# EAGLE design design (EAGLE 9.7.0)
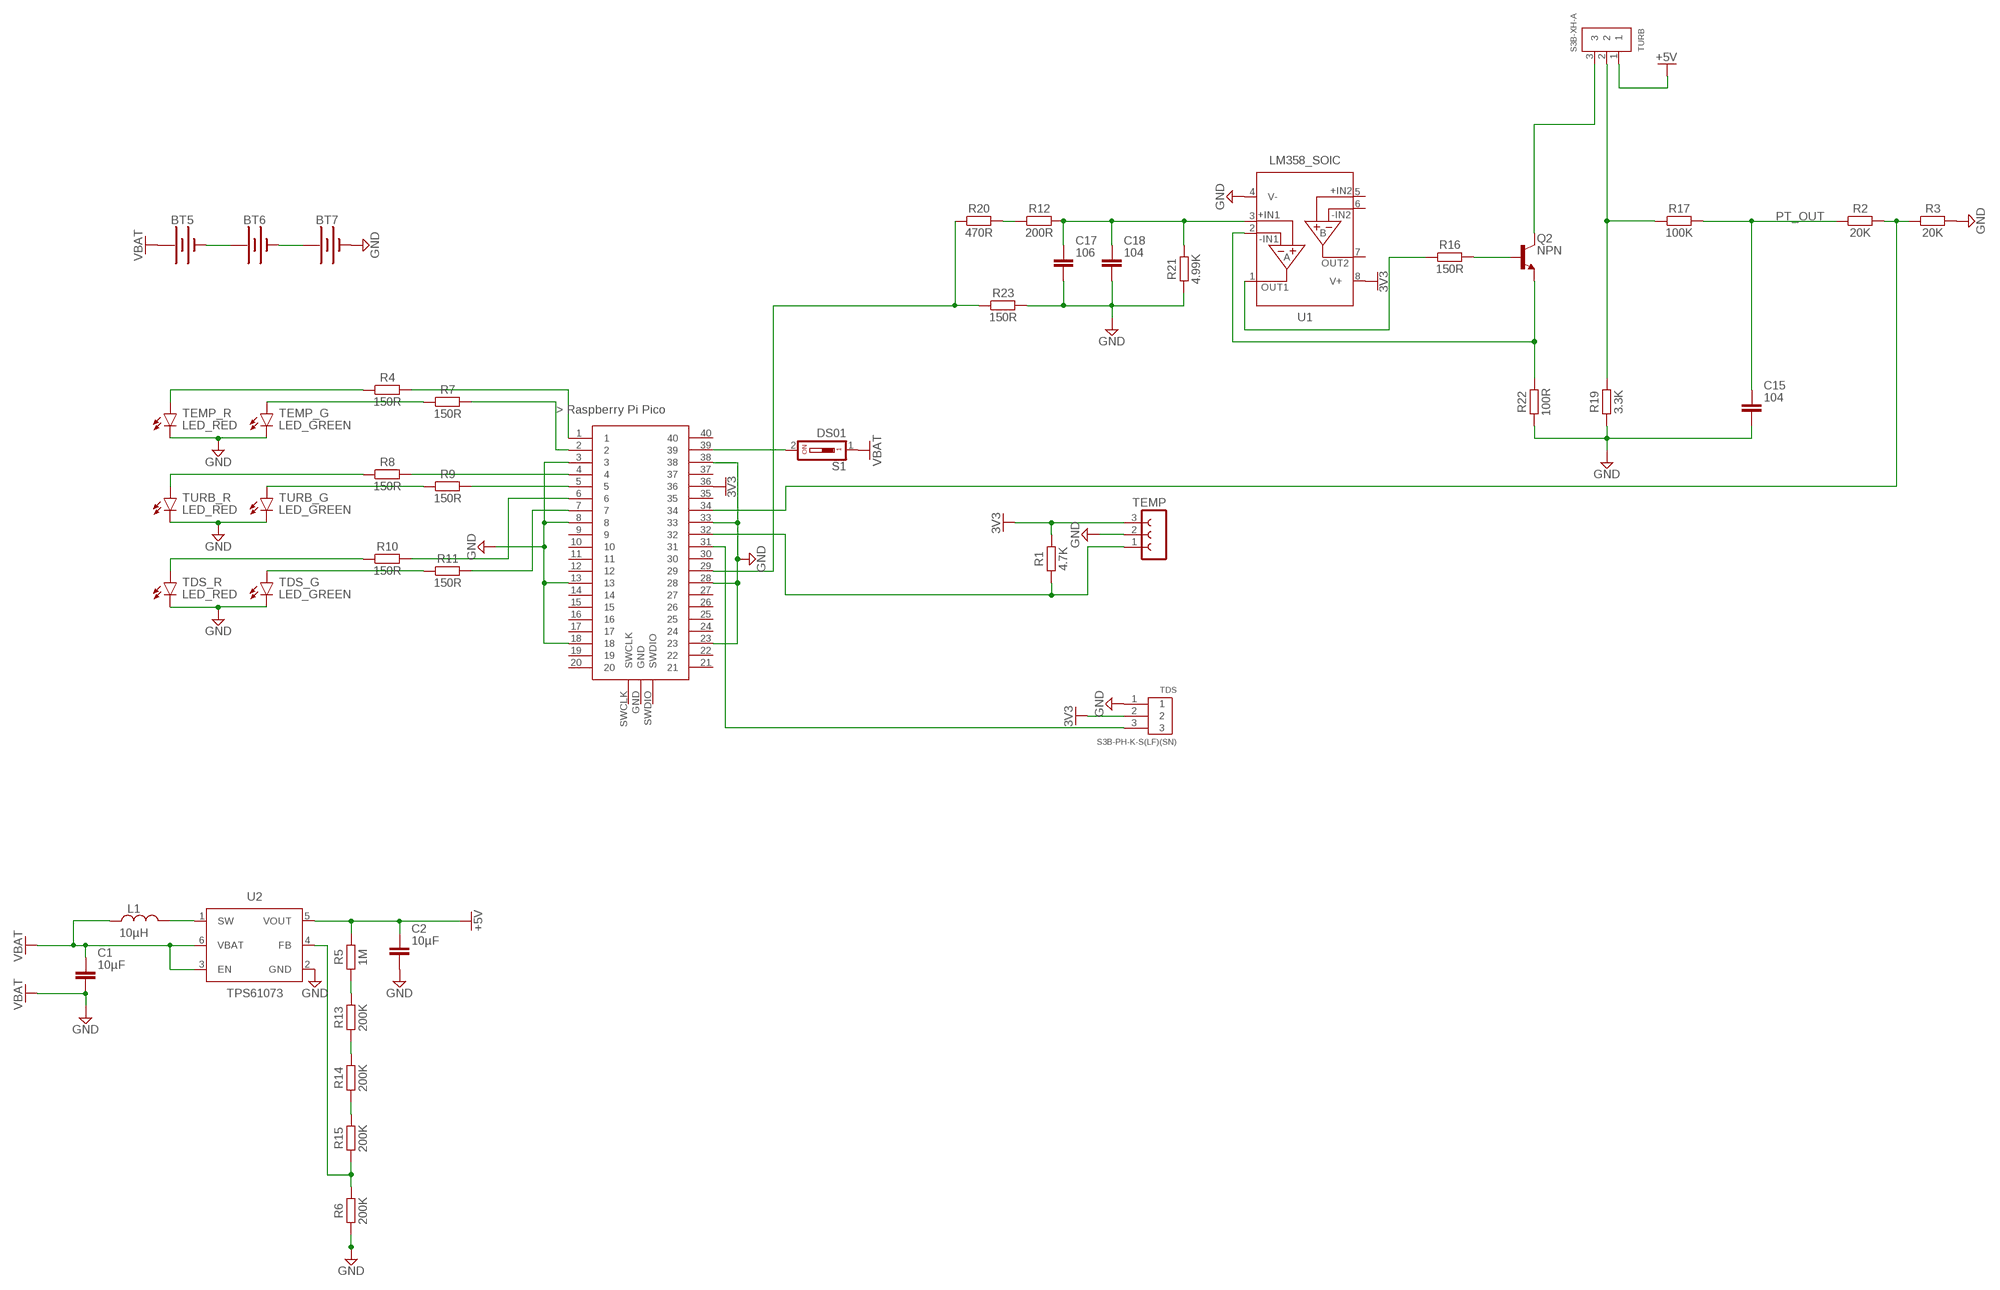
[diagram p0: schematic, sheet 1]

## Parts
BT5  BATTERY-AA_KIT  [BATTERY-AA-KIT]
BT6  BATTERY-AA_KIT  [BATTERY-AA-KIT]
BT7  BATTERY-AA_KIT  [BATTERY-AA-KIT]
C1  10µF  C_CHIP-0805(2012-METRIC)  [CAPC2012X110]
C2  10µF  C_CHIP-0805(2012-METRIC)  [CAPC2012X110]
C15  104  C_CHIP-0402(1005-METRIC)  [CAPC1005X60]
C17  106  C_CHIP-0402(1005-METRIC)  [CAPC1005X60]
C18  104  C_CHIP-0402(1005-METRIC)  [CAPC1005X60]
L1  10µH  L_CHIP-0805(2012-METRIC)  [INDC2009X120]
Q2  NPN  NPN_SOT23-BEC  [SOT95P237X112-3N]
R1  4.7K  R_CHIP-0402(1005-METRIC)  [RESC1005X40]
R2  20K  R_CHIP-0402(1005-METRIC)  [RESC1005X40]
R3  20K  R_CHIP-0402(1005-METRIC)  [RESC1005X40]
R4  150R  R_CHIP-0402(1005-METRIC)  [RESC1005X40]
R5  1M  R_CHIP-0402(1005-METRIC)  [RESC1005X40]
R6  200K  R_CHIP-0402(1005-METRIC)  [RESC1005X40]
R7  150R  R_CHIP-0402(1005-METRIC)  [RESC1005X40]
R8  150R  R_CHIP-0402(1005-METRIC)  [RESC1005X40]
R9  150R  R_CHIP-0402(1005-METRIC)  [RESC1005X40]
R10  150R  R_CHIP-0402(1005-METRIC)  [RESC1005X40]
R11  150R  R_CHIP-0402(1005-METRIC)  [RESC1005X40]
R12  200R  R_CHIP-0402(1005-METRIC)  [RESC1005X40]
R13  200K  R_CHIP-0402(1005-METRIC)  [RESC1005X40]
R14  200K  R_CHIP-0402(1005-METRIC)  [RESC1005X40]
R15  200K  R_CHIP-0402(1005-METRIC)  [RESC1005X40]
R16  150R  R_CHIP-0402(1005-METRIC)  [RESC1005X40]
R17  100K  R_CHIP-0402(1005-METRIC)  [RESC1005X40]
R19  3.3K  R_CHIP-0402(1005-METRIC)  [RESC1005X40]
R20  470R  R_CHIP-0402(1005-METRIC)  [RESC1005X40]
R21  4.99K  R_CHIP-0603(1608-METRIC)  [RESC1608X60]
R22  100R  R_CHIP-0402(1005-METRIC)  [RESC1005X40]
R23  150R  R_CHIP-0402(1005-METRIC)  [RESC1005X40]
S1  DS01  [DS-01]
TDS  S3B-PH-K-S(LF)(SN)  [S3B-PH-K-S(LF)(SN)]
TDS_G  LED_GREEN  CHIP-ROUND-G_0603  [LEDC1608X65N_RND-G]
TDS_R  LED_RED  CHIP-ROUND-R_0603  [LEDC1608X65N_RND-R]
TEMP  FE03-1  [FE03-1]
TEMP_G  LED_GREEN  CHIP-ROUND-G_0603  [LEDC1608X65N_RND-G]
TEMP_R  LED_RED  CHIP-ROUND-R_0603  [LEDC1608X65N_RND-R]
TURB  S3B-XH-A  [S3B-XH-A]
TURB_G  LED_GREEN  CHIP-ROUND-G_0603  [LEDC1608X65N_RND-G]
TURB_R  LED_RED  CHIP-ROUND-R_0603  [LEDC1608X65N_RND-R]
U1  LM358_SOIC  [SOIC127P600X175-8N]
U2  TPS61073  TPS61073DDCR_SOT23  [SOT95P280X110-6N]
U$1  RASPBERRY-PI-PICO_TH  [FT_RASPBERRY-PI-PICO_TH]

## Nets
3V3: R1.2 TDS.2 TEMP.3 U1.8(V+) U$1.36
+5V: C2.1 R5.2 TURB.1 U2.5(VOUT)
GND: BT7.GND@1(-) C1.2 C2.2 C15.2 C17.2 C18.2 R3.2 R6.1 R19.1 R21.1 R22.1 R23.2 TDS.1 TDS_G.C TDS_R.C TEMP.2 TEMP_G.C TEMP_R.C TURB_G.C TURB_R.C U1.4(V-) U2.2(GND) U$1.3 U$1.8 U$1.13 U$1.18 U$1.23 U$1.28 U$1.33 U$1.38 ; supply symbol labelled VBAT
N$1: BT5.GND@1(-) BT6.PWR@1(+)
N$2: BT6.GND@1(-) BT7.PWR@1(+)
N$3: R1.1 TEMP.1 U$1.32
N$4: R20.1 R23.1 U$1.29
N$6: R2.2 R3.1 U$1.34
N$7: TDS.3 U$1.31
N$8: R4.1 TEMP_R.A
N$9: R7.1 TEMP_G.A
N$10: R8.1 TURB_R.A
N$11: R9.1 TURB_G.A
N$12: R11.1 TDS_G.A
N$13: R10.2 U$1.6
N$14: S1.2 U$1.39
N$16: L1.2 U2.1(SW)
N$17: R4.2 U$1.1
N$18: R7.2 U$1.2
N$19: R8.2 U$1.4
N$20: R9.2 U$1.5
N$21: R10.1 TDS_R.A
N$22: R11.2 U$1.7
N$23: R12.1 R20.2
N$24: R5.1 R13.2
N$25: R13.1 R14.2
N$26: R14.1 R15.2
N$27: R6.2 R15.1 U2.4(FB)
N$45: C17.1 C18.1 R12.2 R21.2 U1.3(+IN1)
N$47: R16.1 U1.1(OUT1)
N$48: Q2.1(B) R16.2
N$49: Q2.2(E) R22.2 U1.2(-IN1)
N$50: Q2.3(C) TURB.3
N$51: R17.1 R19.2 TURB.2
PT_OUT: C15.1 R2.1 R17.2
VBAT: BT5.PWR@1(+) C1.1 L1.1 S1.1 U2.3(EN) U2.6(VBAT)
Unconnected: U1.5(+IN2) U1.6(-IN2) U1.7(OUT2) U$1.9 U$1.10 U$1.11 U$1.12 U$1.14 U$1.15 U$1.16 U$1.17 U$1.19 U$1.20 U$1.21 U$1.22 U$1.24 U$1.25 U$1.26 U$1.27 U$1.30 U$1.35 U$1.37 U$1.40 U$1.GND U$1.SWCLK U$1.SWDIO

## Library data of the parts
BT5-BT7 = SparkFun-Batteries:BATTERY: Battery - Single Cell A variety of battery chemistries, sizes, and footprints. Device List: 20MM_PTH - Coin Cell Battery Holder - 20mm (PTH) <https://www.sparkfun.com/products/783> 20MM_PTH_KIT- Coin Cell battery Holder - 20 mm (PTH) <http://www.sparkfun.com/products/783>kit version with special mask 6.8MM_PTH - Coin Cell Battery Holder - 6.8MM(SMD) <https://www.digikey.com/product-detail/en/seiko-instruments/MS621FE-FL11E/728-1057-ND/1889208?WT.srch=1&gclid=CNOQ5a6LzdQCFZS2wAodXCkE0g> 12MM_SMD - Coin Cell Battery Holder - 12mm (SMD) <https://www.sparkfun.com/products/10592> 12MM_PTH - Coin Cell Battery Holder - 12mm (PTH) <https://www.sparkfun.com/products/7948> 20MM_SMD - 20mm Coin Cell Battery Holder (SMD) (2 legs) Used on the Big Time Watch Kit <https://www.sparkfun.com/products/11734> 20MM_SMD_4LEGS - Coin Cell Battery Holder - 20mm (SMD) <https://www.sparkfun.com/products/11892> 20MM_SMD_4LEGS_OVERPASTE - Coin Cell Battery Holder - 20mm (SMD) <https://www.sparkfun.com/products/11892> (Over-paste on the legs) 24.5MM_PTH - Coin Cell Battery Holder - 24.5mm (PTH) <https://www.sparkfun.com/products/8863> 9V - 9V Battery Holder - PC Mount Used on the SparkFun SparkPunk Sound Kit <https://www.sparkfun.com/products/11177> and SparkFun SparkPunk Sequencer Kit <https://www.sparkfun.com/products/12707> 18650 - Battery Holder - 18650 (PTH) <https://www.sparkfun.com/products/13113> AA - Battery Holder - 1xAA (PTH) <https://www.sparkfun.com/products/7949> AAA - Battery Holder - 1xAAA (PTH) <https://www.sparkfun.com/products/12718> AA_KIT - Battery Holder - 1xAA (PTH) <https://www.sparkfun.com/products/7949> Special kit package - pads only have exposed copper on one side of the board. AAA_KIT - Battery Holder - 1xAAA (PTH) <https://www.sparkfun.com/products/12718> Special kit package - pads only have exposed copper on one side of the board.; PROD_ID: BATT-08316; SF_SKU: PRT-07949
C1 C2 C15 C17 C18 = Capacitor:C: Capacitor - Generic; CATEGORY: Capacitor
L1 = Inductor:L: Inductor Fixed - Generic; CATEGORY: Inductor; SUB-CATEGORY: Fixed
Q2 = Transistor:NPN: NPN - Generic; CATEGORY: Transistor; SUB-CATEGORY: BJT; TYPE: NPN
R1-R17 R19-R23 = Resistor:R: Resistor Fixed - Generic; CATEGORY: Resistor; SUB-CATEGORY: Fixed
S1 = Switch:DS01: DIL/CODE SWITCH; CATEGORY: SWITCH; TYPE: SPST
TDS = Headers:S3B-PH-K-S(LF)(SN): CONN HEADER R/A 4POS 2MM Manufacturer's datasheet <http://www.jst-mfg.com/product/pdf/eng/ePH.pdf>
TDS_G TEMP_G TURB_G = LED:CHIP-ROUND-G; CATEGORY: LED; COLOR: GREEN; DESCRIPTION: CHIP LED ROUND; SUB-CATEGORY: CHIP; TYPE: ROUND_TOP
TDS_R TEMP_R TURB_R = LED:CHIP-ROUND-R: LED - Generic; CATEGORY: LED; COLOR: RED; DESCRIPTION: CHIP LED ROUND; SUB-CATEGORY: CHIP; TYPE: ROUND_TOP
TEMP = con-lsta:FE03-1: FEMALE HEADER
TURB = Connector:S3B-XH-A; CATEGORY: Header; DESCRIPTION: Connector Header Through Hole, Right Angle 3 position 0.098" (2.50mm); MANUFACTURER: JST Sales America Inc.; MPN: S3B-XH-A(LF)(SN); OPERATING_TEMPERATURE: -25°C ~ 85°C; PART_STATUS: Active; PITCH: 0.098" (2.50mm); ROHS_COMPLIANCE: ROHS3 Compliant; SERIES: XH; SUBCATEGORY: Rectangular Connectors; TYPE: Header, Male Pin, Board to Cable/Wire, Through Hole
U1 = IC_Linear:LM358: Dual Operational Amplifier Reference Datasheet <https://www.ti.com/lit/ds/symlink/lm158-n.pdf>; CATEGORY: Amplifier; DESCRIPTION: Dual Operational Amplifier; MANUFACTURER: Generic; MPN: Generic; SERIES: LM358; SUB-CATEGORY: OpAmp; TYPE: Dual
U2 = IC_Power-Management:TPS6107: Synchronous Boost Converter With 600-mA Switch Datasheet <https://www.ti.com/lit/ds/symlink/tps61070.pdf?ts=1593507986589&ref_url=https%253A%252F%252Fwww.ti.com%252Fstore%252Fti%252Fen%252Fp%252Fproduct%252F%253Fp%253DTPS61070DDCR>; CATEGORY: IC_Power-Management; DESCRIPTION: IC REG BOOST ADJ 500MA TSOT23-6; INPUT_VOLTAGE: 0.9V to 5.5V; MANUFACTURER: TI; MPN: TPS61073DDCR; OPERATING_TEMP: -40°C ~ 85°C; OUTPUT_VOLTAGE: 1.8V to 5.5V; PART_STATUS: Active; ROHS_COMPLIANT: Yes; SUB-CATEGORY: Voltage Regulator; TOPOLOGY: Boost; TYPE: DC-DC Switching
U$1 = Pipico (1):RASPBERRY-PI-PICO_TH: Raspberry Pi Pico microcontroller board for through-hole mounting.

## Board
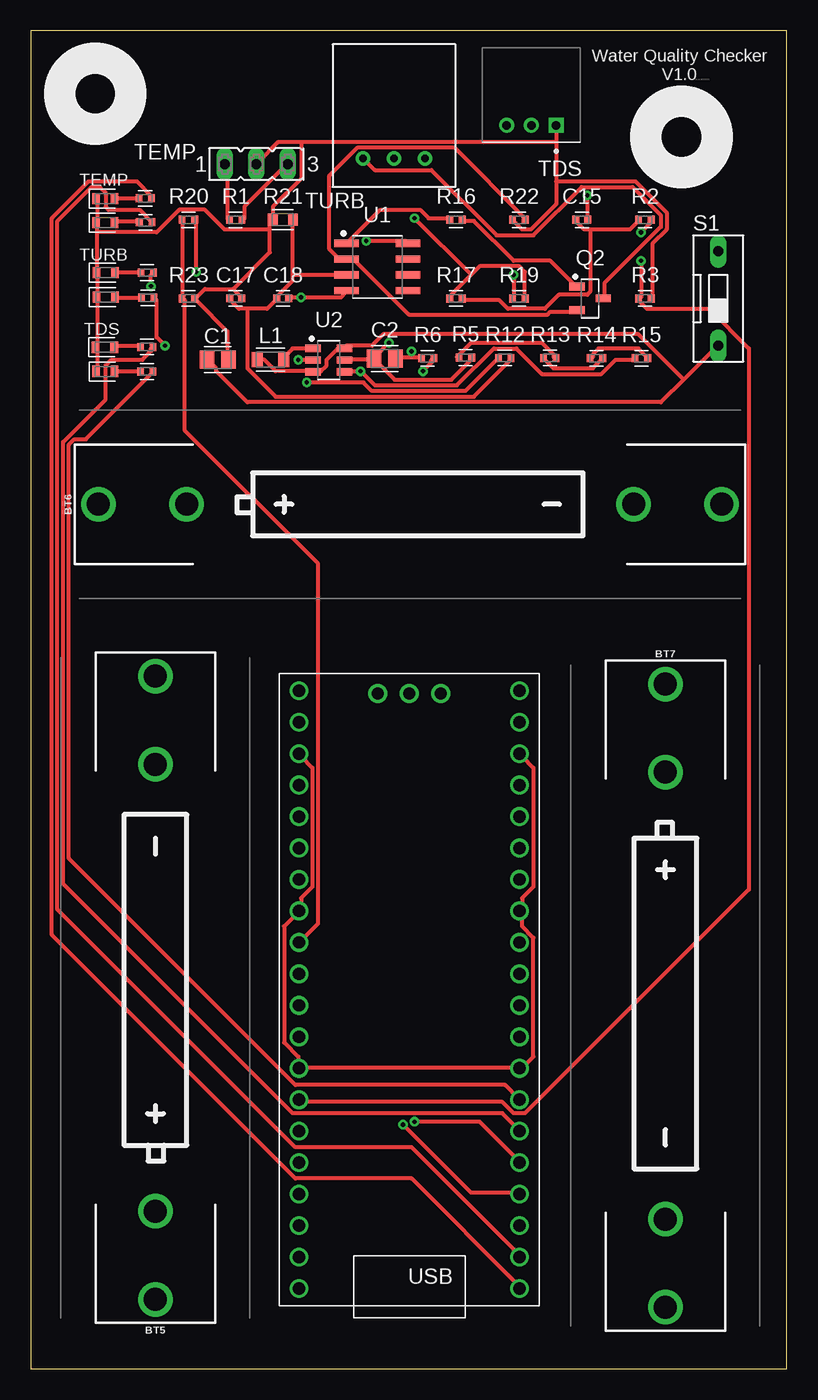
[diagram p1: board, top side]
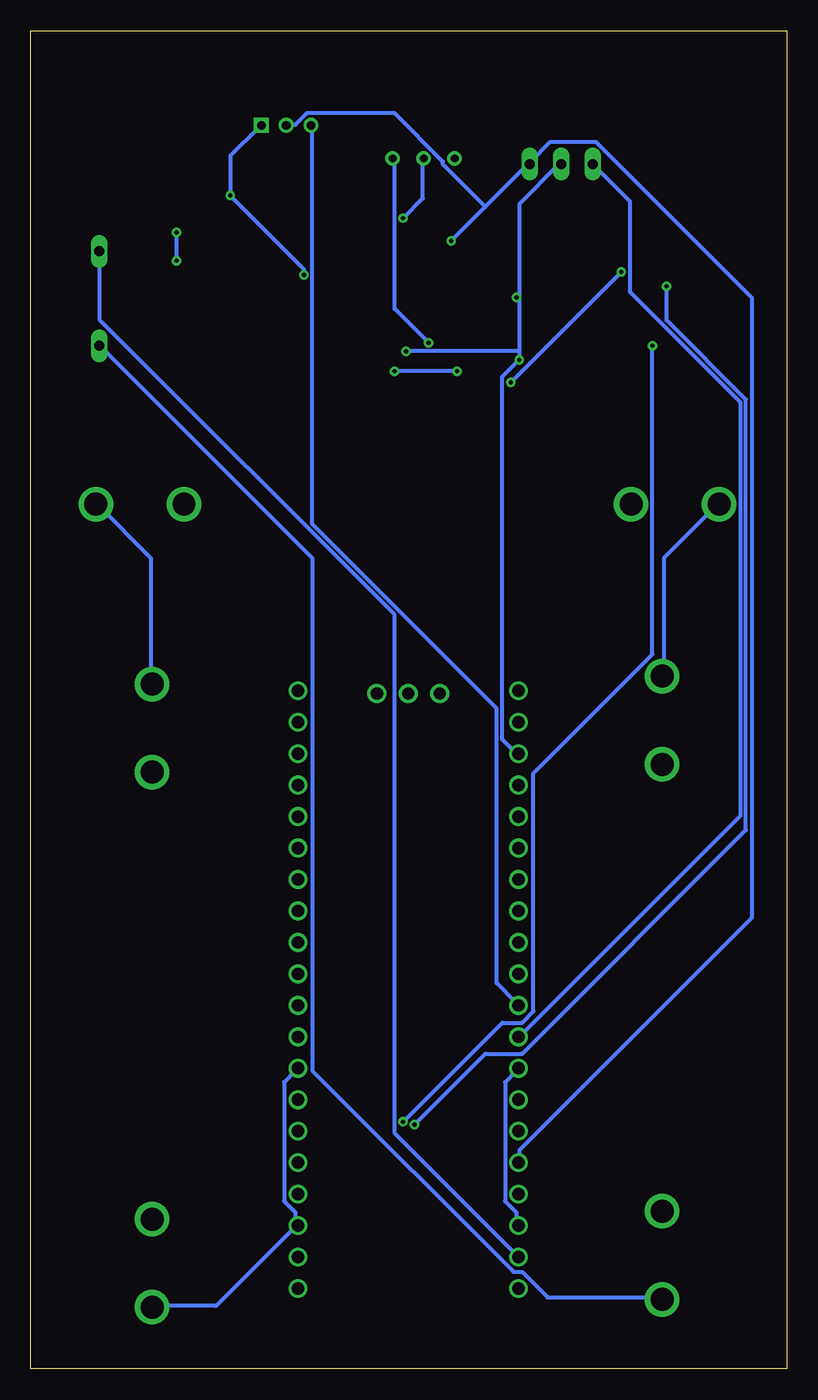
[diagram p2: board, bottom side, seen from below]

Size 60.96 x 107.95 mm. Coordinates in mm from the lower left corner, seen from the top.
Outline: 0,107.95 0,0 60.96,0 60.96,107.95 0,107.95
Copper layers (1*16): Top / Bottom
Stack-up Default Layer Stack: Top User Defined 0.035mm / Dielectric-1 User Defined 1.5mm / Bottom User Defined 0.035mm
Design rules: minimum drill size 0.35mm, minimum copper width 12mil, keepout clearance 0mil, drill distance 6mil, via restrict clearance 0mil, solder-mask clearance 0mil, dimension clearance 40mil, restrict clearance 0mil, copper clearance wire_polygon to wire_polygon 6mil, copper clearance wire_polygon to pad_smd 6mil, copper clearance wire_polygon to via 6mil, copper clearance pad_smd to pad_smd 6mil, copper clearance pad_smd to via 6mil, copper clearance via to via 6mil, copper clearance smd to pad (same net) 6mil, copper clearance smd to via (same net) 6mil, copper clearance smd to smd (same net) 6mil

### Footprints (pad centres in the part's own frame; a part is rotated, then mirrored left to right if it is on the bottom)
BATTERY-AA-KIT = drill 1.854: GND@1 25.146,0; GND@2 18.034,0; PWR@1 -25.146,0; PWR@2 -18.034,0
CAPC2012X110 = smd 1.165 x 1.465: 1 -0.875,0; 2 0.875,0
CAPC1005X60 = smd 0.56 x 0.629: 1 -0.485,0; 2 0.485,0
INDC2009X120 = smd 0.876 x 1.21: 1 -1.067,0; 2 1.067,0
SOT95P237X112-3N = smd 1.224 x 0.625: 1 -1.064,0.95; 2 -1.064,-0.95; 3 1.064,0
RESC1005X40 = smd 0.535 x 0.644: 1 -0.507,0; 2 0.507,0
RESC1608X60 = smd 0.799 x 0.974: 1 -0.815,0; 2 0.815,0
DS-01 = drill 0.813 long: 1 0,-3.81; 2 0,3.81
S3B-PH-K-S(LF)(SN) = drill 0.7 square: 1 -3,0 | drill 0.7: 2 -1,0; 3 1,0
LEDC1608X65N_RND-G = smd 0.612 x 0.912: A 0.75,0; C -0.75,0
LEDC1608X65N_RND-R = smd 0.612 x 0.912: A 0.75,0; C -0.75,0
FE03-1 = drill 0.813 long: 1 -5.08,0; 2 -2.54,0; 3 0,0
S3B-XH-A = drill 0.64: 1 0,0; 2 2.5,0; 3 5,0
SOIC127P600X175-8N = smd 1.969 x 0.592: 1 -2.474,1.905; 2 -2.474,0.635; 3 -2.474,-0.635; 4 -2.474,-1.905; 5 2.474,-1.905; 6 2.474,-0.635; 7 2.474,0.635; 8 2.474,1.905
SOT95P280X110-6N = smd 1.25 x 0.589: 1 -1.256,0.95; 2 -1.256,0; 3 -1.256,-0.95; 4 1.256,-0.95; 5 1.256,0; 6 1.256,0.95
FT_RASPBERRY-PI-PICO_TH = drill 1: 1 -8.55,24.03; 2 -8.55,21.49; 3 -8.55,18.95; 4 -8.55,16.41; 5 -8.55,13.87; 6 -8.55,11.33; 7 -8.55,8.79; 8 -8.55,6.25; 9 -8.55,3.71; 10 -8.55,1.17; 11 -8.55,-1.37; 12 -8.55,-3.91; 13 -8.55,-6.45; 14 -8.55,-8.99; 15 -8.55,-11.53; 16 -8.55,-14.07; 17 -8.55,-16.61; 18 -8.55,-19.15; 19 -8.55,-21.69; 20 -8.55,-24.23; 21 9.23,-24.23; 22 9.23,-21.69; 23 9.23,-19.15; 24 9.23,-16.61; 25 9.23,-14.07; 26 9.23,-11.53; 27 9.23,-8.99; 28 9.23,-6.45; 29 9.23,-3.91; 30 9.23,-1.37; 31 9.23,1.17; 32 9.23,3.71; 33 9.23,6.25; 34 9.23,8.79; 35 9.23,11.33; 36 9.23,13.87; 37 9.23,16.41; 38 9.23,18.95; 39 9.23,21.49; 40 9.23,24.03; GND 0.34,-24; SWCLK -2.2,-24; SWDIO 2.88,-24

### Placement (x,y rotation side)
BT5  10.04,30.73 90 top
BT6  30.58,69.75 0 top
BT7  51.19,30.09 270 top
C1  15.06,81.43 0 top
C2  28.54,81.51 0 top
C15  44.45,92.71 0 top
C17  16.51,86.36 0 top
C18  20.32,86.36 0 top
L1  19.33,81.43 0 top
Q2  45.11,86.36 0 top
R1  16.51,92.71 0 top
R2  49.53,92.71 0 top
R3  49.53,86.36 0 top
R4  9.22,94.44 0 top
R5  35.05,81.58 0 top
R6  32,81.53 0 top
R7  9.25,92.51 0 top
R8  9.37,88.44 0 top
R9  9.42,86.41 0 top
R10  9.35,82.45 0 top
R11  9.35,80.47 0 top
R12  38.23,81.56 0 top
R13  41.86,81.56 0 top
R14  45.62,81.53 0 top
R15  49.25,81.53 0 top
R16  34.29,92.71 0 top
R17  34.29,86.36 0 top
R19  39.37,86.36 0 top
R20  12.7,92.71 0 top
R21  20.32,92.71 0 top
R22  39.37,92.71 0 top
R23  12.7,86.36 0 top
S1  55.45,86.36 0 top
TDS  39.37,100.33 180 top
TDS_G  5.99,80.47 0 top
TDS_R  5.97,82.42 0 top
TEMP  20.73,97.21 0 top
TEMP_G  5.99,92.48 0 top
TEMP_R  5.99,94.41 0 top
TURB  31.79,97.66 180 top
TURB_G  6.02,86.46 0 top
TURB_R  6.02,88.44 0 top
U1  27.94,88.9 0 top
U2  24.03,81.38 0 top
U$1  30.86,30.48 180 top

### Tracks (layer width: path | path; a pad name or v marks a point on that pad's centre or on a via)
3V3  (via drill 0.35)
  Top 0.305: R1.2 17.22,92.84 17.22,93.75 20.65,97.18 TEMP.3 | v27.05,91.01 30.25,91.01 U1.8
  Bottom 0.305: 24.31,93.75 20.88,97.18 TEMP.3 20.65,97.41 19.05,99.01 15.39,99.01 2.82,86.44 2.82,36.37 21.57,17.63 21.57,16.71 U$1.36 | 24.31,93.75 v27.05,91.01 | 24.31,93.75 27.74,97.18 27.74,97.41 31.62,101.29 38.71,101.29 39.62,100.38 40.31,100.38 TDS.2
+5V  (via drill 0.35)
  Top 0.305: R5.2 35.51,81.41 33.91,79.81 29.34,79.81 27.74,81.41 C2.1 | U2.5 25.45,81.41 27.51,81.41 C2.1 | v28.88,82.78 27.74,81.64 C2.1
  Bottom 0.305: v28.88,82.78 31.62,85.52 31.62,97.64 TURB.1
GND  (via drill 0.35)
  Top 0.305: TDS_G.C 5.33,80.49 5.33,82.32 TDS_R.C 5.33,82.55 5.33,86.44 TURB_G.C 5.33,86.66 5.33,88.27 TURB_R.C 5.33,88.49 5.33,91.69 | TEMP_R.C 5.33,94.21 5.33,92.61 TEMP_G.C 5.33,92.38 5.33,91.69 | 16.31,87.12 16.99,86.44 C17.2 | 16.31,87.12 14.02,87.12 13.34,86.44 R23.2 13.34,86.21 15.85,83.69 15.85,81.64 C1.2 | 19.28,91.92 19.28,90.09 16.31,87.12 | 19.28,91.92 19.28,92.61 R21.1 19.51,92.84 19.51,93.75 21.79,96.04 21.79,99.01 | 5.33,91.69 10.14,91.69 11.96,93.52 14.02,93.52 15.62,91.92 19.28,91.92 | v44.88,94.67 44.88,92.84 C15.2 | v38.94,88.27 38.94,86.44 R19.1 | 42.37,99.01 42.37,100.15 TDS.1 | 42.37,99.01 42.37,95.81 | 42.37,95.81 42.37,93.98 40.31,91.92 39.62,91.92 38.94,92.61 R22.1 | 42.37,95.81 48.77,95.81 51.28,93.29 51.28,91.92 50.14,90.78 50.14,86.44 R3.2 | C18.2 20.88,86.44 v21.79,86.44 24.99,86.44 25.45,86.89 U1.4 | 30.71,81.64 29.57,81.64 C2.2 | 30.71,81.64 31.39,81.64 R6.1 | v21.57,81.41 22.71,81.41 U2.2 | v30.71,82.09 30.71,81.64 | 21.79,99.01 19.96,99.01 18.36,97.41 TEMP.2 | 21.79,99.01 42.37,99.01 | U$1.23 21.79,49.4 22.71,48.49 22.71,38.89 21.79,37.97 21.79,37.06 U$1.28 21.57,36.83 20.42,35.69 20.42,26.31 21.57,25.17 21.57,24.26 U$1.33 21.79,24.26 39.39,24.26 U$1.8 39.62,24.26 40.54,25.17 40.54,34.77 39.62,35.69 39.62,36.83 U$1.13 39.62,37.06 39.62,37.97 40.54,38.89 40.54,48.49 39.62,49.4 U$1.18
  Bottom 0.305: TDS.1 42.6,100.15 44.88,97.87 v44.88,94.67 38.94,88.72 v38.94,88.27 | 21.57,86.44 21.57,93.98 18.36,97.18 TEMP.2 | 21.57,86.44 21.57,82.09 | 21.57,82.09 v21.57,81.41 22.94,80.03 22.94,50.77 21.79,49.63 U$1.23 | 21.57,82.09 v30.71,82.09 | 21.57,86.44 v21.79,86.44 | U$1.38 21.79,11.68 21.79,12.6 22.71,13.51 22.71,23.11 21.79,24.03 U$1.33 | U$1.8 39.62,24.03 40.54,23.11 40.54,13.51 39.62,12.6 39.62,11.68 U$1.3 39.62,11.45 46.02,5.05 51.05,5.05 BT7.GND@1
N$1
  Bottom 0.305: BT5.GND@1 9.91,56.03 9.91,65.41 5.56,69.75 BT6.PWR@1
N$2
  Bottom 0.305: BT7.PWR@1 51.28,55.35 51.28,65.41 55.63,69.75 BT6.GND@1
N$3
  Top 0.305: R1.1 15.85,92.84 15.85,97.18 TEMP.1
  Bottom 0.305: TEMP.1 12.65,94.21 12.65,86.89 3.73,77.98 3.73,44.6 21.57,26.77 U$1.32
N$4
  Top 0.305: R20.1 12.19,92.61 12.19,86.44 R23.1 12.42,86.21 12.42,75.69 23.16,64.95 23.16,35.92 21.79,34.54 U$1.29
N$6  (via drill 0.35)
  Top 0.305: v49.23,89.41 49.23,86.44 R3.1 49,86.21 49.68,85.52 54.71,85.52 57.91,82.32 57.91,38.66 39.85,20.6 38.94,20.6 38.02,21.51 21.79,21.51 U$1.34 | v49.23,91.69 50.14,92.61 R2.2
  Bottom 0.305: v49.23,91.69 v49.23,89.41
N$7
  Bottom 0.305: TDS.3 38.25,100.15 38.25,68.15 23.39,53.29 23.39,31.11 21.79,29.51 U$1.31
N$8
  Top 0.305: R4.1 6.93,94.44 TEMP_R.A
N$9
  Top 0.305: R7.1 8.53,92.61 6.93,92.61 TEMP_G.A
N$10
  Top 0.305: R8.1 8.76,88.49 6.93,88.49 TURB_R.A
N$11
  Top 0.305: R9.1 8.76,86.44 6.93,86.44 TURB_G.A
N$12
  Top 0.305: R11.1 8.76,80.49 6.93,80.49 TDS_G.A
N$13
  Top 0.305: R10.2 9.68,82.32 9.68,82.09 8.99,81.41 6.48,81.41 6.02,80.95 6.02,78.21 2.59,74.78 2.59,39.12 21.11,20.6 38.02,20.6 39.39,19.23 U$1.6
N$14
  Bottom 0.305: S1.2 55.4,90.09 55.4,84.61 31.62,60.83 31.62,19 21.79,9.17 U$1.39
N$16
  Top 0.305: L1.2 20.42,81.64 21.11,82.32 22.71,82.32 U2.1
N$17
  Top 0.305: R4.2 9.68,94.44 9.68,94.67 8.53,95.81 4.65,95.81 1.68,92.84 1.68,35 21.34,15.34 30.71,15.34 39.39,6.66 U$1.1
N$18
  Top 0.305: R7.2 9.68,92.61 8.76,93.52 6.25,93.52 6.02,93.75 6.02,94.89 5.56,95.35 4.88,95.35 2.13,92.61 2.13,37.06 21.34,17.86 30.71,17.86 39.39,9.17 U$1.2
N$19  (via drill 0.35)
  Top 0.305: v9.68,87.35 9.68,88.27 R8.2 | v30.02,19.68 35.51,14.2 39.39,14.2 U$1.4
  Bottom 0.305: v9.68,87.35 9.68,84.61 3.28,78.21 3.28,43.46 21.34,25.4 24.31,25.4 v30.02,19.68
N$20  (via drill 0.35)
  Top 0.305: v10.82,82.55 10.14,83.24 10.14,86.21 R9.2 | v30.94,19.91 36.2,19.91 39.39,16.71 U$1.5
  Bottom 0.305: v10.82,82.55 10.82,57.63 20.42,48.03 20.42,28.83 21.34,27.91 22.94,27.91 v30.94,19.91
N$21
  Top 0.305: R10.1 8.76,82.55 6.93,82.55 TDS_R.A
N$22
  Top 0.305: R11.2 9.68,80.26 4.42,75.01 3.5,75.01 3.05,74.55 3.05,41.17 21.34,22.88 38.25,22.88 39.39,21.74 U$1.7
N$23  (via drill 0.35)
  Top 0.305: v13.34,88.49 13.34,92.61 R20.2 | v22.25,79.58 26.82,79.58 27.51,78.89 35.05,78.89 37.57,81.41 R12.1
  Bottom 0.305: v22.25,79.58 v13.34,88.49
N$24
  Top 0.305: R13.2 42.14,81.64 42.14,81.86 41.22,82.78 35.51,82.78 34.37,81.64 R5.1
N$25
  Top 0.305: R14.2 46.02,81.41 45.34,80.72 42.14,80.72 41.45,81.41 R13.1
N$26
  Top 0.305: R14.1 45.34,81.64 45.34,81.86 45.8,82.32 49,82.32 49.68,81.64 R15.2
N$27  (via drill 0.35)
  Top 0.305: v31.62,80.49 32.31,81.18 32.31,81.41 R6.2 | U2.4 25.45,80.49 v26.59,80.49 27.74,79.35 34.37,79.35 37.34,82.32 39.17,82.32 41.22,80.26 46.02,80.26 47.17,81.41 48.54,81.41 R15.1
  Bottom 0.305: v26.59,80.49 v31.62,80.49
N$45
  Top 0.305: 17.45,85.52 19.05,85.52 19.74,86.21 C18.1 19.74,86.44 21.11,87.81 21.11,88.27 | 17.45,85.52 16.76,85.52 16.08,86.21 C17.1 | 17.45,85.52 17.45,80.72 19.74,78.44 35.74,78.44 38.71,81.41 R12.2 | 21.11,88.27 21.11,92.61 R21.2 | 21.11,88.27 U1.3
N$47
  Top 0.305: R16.1 33.68,92.84 32.08,92.84 31.39,93.52 28.19,93.52 25.68,91.01 U1.1
N$48
  Top 0.305: R16.2 34.82,92.61 35.74,92.61 38.94,89.41 41.91,89.41 43.97,87.35 Q2.1
N$49
  Top 0.305: R22.2 39.85,92.84 34.14,98.55 26.37,98.55 24.08,96.27 24.08,90.32 24.77,89.64 25.45,89.64 U1.2 25.68,89.41 26.14,89.41 30.48,85.06 41.68,85.06 41.91,85.29 43.97,85.29 Q2.2
N$50
  Top 0.305: Q2.3 46.25,86.44 46.25,87.58 50.83,92.15 50.83,93.07 48.54,95.35 44.42,95.35 40.54,91.47 37.57,91.47 32.31,96.72 27.74,96.72 26.82,97.64 TURB.3
N$51  (via drill 0.35)
  Top 0.305: 35.51,88.27 36.2,88.95 39.39,88.95 39.85,88.49 39.85,86.44 R19.2 | 35.51,88.27 33.91,86.66 33.91,86.44 R17.1 | 35.51,88.27 v30.94,92.84
  Bottom 0.305: v30.94,92.84 29.34,94.44 29.34,97.64 TURB.2
PT_OUT
  Top 0.305: 45.11,91.92 48.31,91.92 49,92.61 R2.1 | 45.11,91.92 44.65,91.92 43.97,92.61 C15.1 | 45.11,91.92 45.11,86.89 44.88,86.66 42.6,86.66 41.45,85.52 38.48,85.52 37.8,86.21 34.82,86.21 R17.2
VBAT
  Top 0.305: L1.1 18.36,81.41 18.82,81.41 19.74,80.49 22.71,80.49 U2.3 22.94,80.49 23.39,80.49 23.85,80.95 23.85,81.41 24.77,82.32 25.22,82.32 U2.6 25.45,82.55 27.51,82.55 28.42,83.46 49,83.46 52.65,79.81 | 52.65,79.81 55.4,82.55 S1.1 | 52.65,79.81 50.83,77.98 17.45,77.98 14.94,80.49 14.94,80.72 14.25,81.41 C1.1
  Bottom 0.305: BT5.PWR@1 10.14,5.74 19.28,5.74 21.34,7.8 22.02,7.8 38.25,24.03 38.25,65.41 55.4,82.55 S1.1

### Text on the board
SilkscreenTop: Water Quality Checker / V1.0 | Easter EGGGGG
NamesTop: TEMP | TURB | TDS